# Altium schematic sheet TTP223-BA6_2023-03-04.schdoc
size 54 x 32 mm
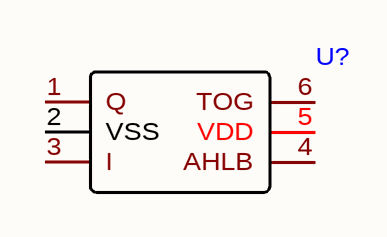
[diagram p0: TTP223-BA6_2023-03-04.schdoc]

## Parts
U?  (no value)  [TTP223-BA6_SOT23]

## Nets

Not connected (* = marked no-connect by the designer): U? 1(Q) 2(VSS) 3(I) 4(AHLB) 5(VDD) 6(TOG)

## Library data of the parts
U? = TTP223-BA6